# Altium project 88DianZhen.PrjPcb
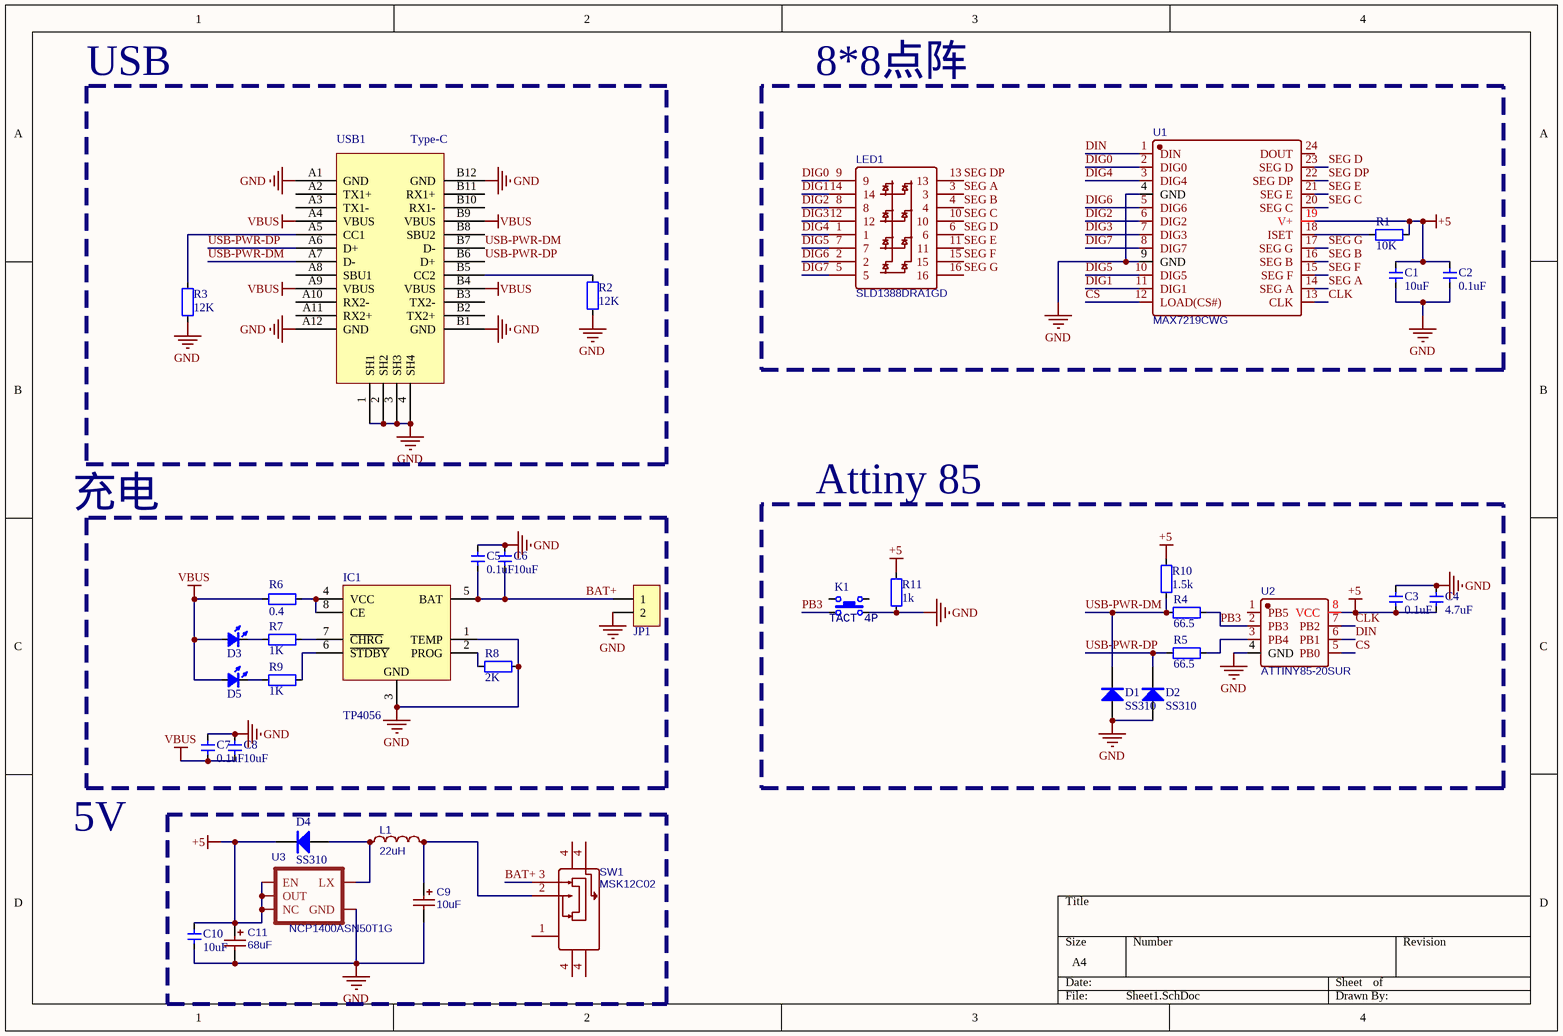
[diagram p0: Sheet1.SchDoc]
1 sheet, 37 parts. Net scope: global (net labels, ports and power ports of the same name join across sheets).
Board file: PCB1.PcbDoc

## Sheet Sheet1.SchDoc
size A4

### Parts
C1  10uF  [CAP_0402]
C2  0.1uF  [CAP_0402]
C3  0.1uF  [CAP_0402]
C4  4.7uF  [CAP_0402]
C5  0.1uF  [CAP_0402]
C6  10uF  [CAP_0402]
C7  0.1uF  [CAP_0402]
C8  10uF  [CAP_0402]
C9  10uF  [CAP-SMD_L3.2-W1.6-RD]
C10  10uF  [CAP_0402]
C11  68uF  [CAP-SMD_L3.5-W2.8]
D1  SS310  [SMA]
D2  SS310  [SMA]
D3  color?  [LED_0402_RED]  (value not drawn)
D4  SS310  [SMA]
D5  color?  [LED_0402_RED]  (value not drawn)
IC1  TP4056  [SOP8]
JP1  HDR-1X2  [KF2EDGK-2.54-LI-2P]  (value not drawn)
K1  TACT 4P  [ButtonTACT_3.5*3.55_90]
L1  22uH  [IND-SMD_L4.5-W4.0_SCD0403T]
LED1  SLD1388DRA1GD  [8*8点阵]
R1  10K  [R_0402]
R2  12K  [R_0402]
R3  12K  [R_0402]
R4  66.5  [0603R]
R5  66.5  [0603R]
R6  0.4  [1210R]
R7  1K  [R_0402]
R8  2K  [R_0402]
R9  1K  [R_0402]
R10  1.5k  [R_0402]
R11  1k  [R_0402]
SW1  MSK12C02  [SW-TH_MSK12C02]
U1  MAX7219CWG  [SOIC-24_L15.4-W7.5-P1.27-LS10.3-BL]
U2  ATTINY85-20SUR  [SOIC-8_L5.3-W5.3-P1.27-LS8.2-BL]
U3  NCP1400ASN50T1G  [SOT23-5]
USB1  Type-C  [Type-C-TOP]

### Blocks framed on the sheet
USB: R2 R3 USB1
8*8点阵: C1 C2 LED1 R1 U1
Attiny 85: C3 C4 D1 D2 K1 R4 R5 R10 R11 U2

### Nets
+5: C1.2 C2.2 C3.1 C4.1 C10.2 C11.1 D4.2(K) R1.2 R10.2 R11.2 U1.19(V+) U2.8(VCC) U3.1(EN) U3.2(OUT) U3.3(NC)
GND: C1.1 C2.1 C3.2 C4.2 C5.2 C6.2 C7.2 C8.2 C9.2 C10.1 C11.2 D1.1(A) D2.1(A) IC1.1(TEMP) IC1.3(GND) JP1.2 K1.4 R2.2 R3.2 R8.2 R11.1 U1.4(GND) U1.9(GND) U2.4(GND) U3.4(GND) USB1.1(SH1) USB1.2(SH2) USB1.3(SH3) USB1.4(SH4) USB1.A1(GND) USB1.A12(GND) USB1.B1(GND) USB1.B12(GND)
VBUS: C7.1 C8.1 D3.1(A) D5.1(A) R6.2 USB1.A4(VBUS) USB1.A9(VBUS) USB1.B4(VBUS) USB1.B9(VBUS)
BAT+: C5.1 C6.1 IC1.5(BAT) JP1.1 SW1.3
CLK: U1.13(CLK) U2.7(PB2)
CS: U1.12(LOAD(CS#)) U2.5(PB0)
DIG0: LED1.9 U1.2(DIG0)
DIG1: LED1.14 U1.11(DIG1)
DIG2: LED1.8 U1.6(DIG2)
DIG3: LED1.12 U1.7(DIG3)
DIG4: LED1.1 U1.3(DIG4)
DIG5: LED1.7 U1.10(DIG5)
DIG6: LED1.2 U1.5(DIG6)
DIG7: LED1.5 U1.8(DIG7)
DIN: U1.1(DIN) U2.6(PB1)
PB3: K1.3 R4.2 U2.2(PB3)
SEG A: LED1.3 U1.14(SEG_A)
SEG B: LED1.4 U1.16(SEG_B)
SEG C: LED1.10 U1.20(SEG_C)
SEG D: LED1.6 U1.23(SEG_D)
SEG DP: LED1.13 U1.22(SEG_DP)
SEG E: LED1.11 U1.21(SEG_E)
SEG F: LED1.15 U1.15(SEG_F)
SEG G: LED1.16 U1.17(SEG_G)
USB-PWR-DM: D1.2(K) R4.1 R10.1 USB1.A7(D-) USB1.B7(D-)
USB-PWR-DP: D2.2(K) R5.1 USB1.A6(D+) USB1.B6(D+)
NetC9_1: C9.1 L1.2 SW1.2
NetD3_2: D3.2(K) R7.1
NetD4_1: D4.1(A) L1.1 U3.5(LX)
NetD5_2: D5.2(K) R9.1
NetIC1_2: IC1.2(PROG) R8.1
NetIC1_4: IC1.4(VCC) IC1.8(CE) R6.1
NetIC1_6: IC1.6(~{STDBY}) R9.2
NetIC1_7: IC1.7(~{CHRG}) R7.2
NetR1_1: R1.1 U1.18(ISET)
NetR2_1: R2.1 USB1.B5(CC2)
NetR3_1: R3.1 USB1.A5(CC1)
NetR5_2: R5.2 U2.3(PB4)

Not connected (* = marked no-connect by the designer): K1 1 2; SW1 1 4; U1 24(DOUT); U2 1(PB5); USB1 A2(TX1+) A3(TX1-) A8(SBU1) A10(RX2-) A11(RX2+) B2(TX2+) B3(TX2-) B8(SBU2) B10(RX1-) B11(RX1+)

### Notes on the sheet
- 充电
- 5V

### Library data of the parts
C1-C8 C10 = 电容-0402: Capacitor; Value: 0.1u
C9 C11 = 钽电容: BOM_Manufacturer: Xiangyee; BOM_Manufacturer Part: CA45-A010M106T; nameAlias: Capacitance; Contributor: LCSC; Package Display: Yes; BOM_Supplier: LCSC; BOM_Supplier Part: C127946; BOM_JLCPCB Part Class: Extended Part; spicePre: C; spiceSymbolName: CA45-A010M106T
D1 D2 = SS210: 肖特基二极管; 版权归属: 源创客; BOM名称: 肖特基二极管; 学习资源: www.ooocke.com
D3 D5 = LED_0402: LED; Type: 0402; Value: color?
D4 = 二极管: 肖特基二极管; 版权归属: 源创客; BOM名称: 肖特基二极管; 学习资源: www.ooocke.com
IC1 = TP4056: 锂电池充电管理; 版权归属: 源创客; BOM名称: 锂电池充电管理; 学习资源: www.ooocke.com
JP1 = Header 2: 2P接插件; 版权归属: 源创客; BOM名称: 2P接插件; 学习资源: www.ooocke.com
K1 = ButtonTACT: Button; type: TACT 4P
L1 = 电感: BOM_Manufacturer: TAITEC; BOM_Manufacturer Part: FPI0403F-220M; nameAlias: Inductance; Contributor: LCSC; Package Display: Yes; BOM_Supplier: LCSC; BOM_Supplier Part: C304283; spicePre: L; spiceSymbolName: FPI0403F-220M
LED1 = SLD1388DRA1GD: BOM_Manufacturer: SUNLIGHT; Contributor: LCSC; Package Display: Yes; BOM_Supplier: LCSC; BOM_Supplier Part: C225991; BOM_Manufacturer Part: SLD1388DRA1GD; BOM_JLCPCB Part Class: Extended Part; spicePre: L; spiceSymbolName: SLD1388DRA1GD
R1-R11 = 电阻-0402: Resistor; Value: 22R
SW1 = MSK12C02: BOM_Manufacturer: SHOU HAN; Contributor: LCSC; Package Display: Yes; BOM_Supplier: LCSC; BOM_Supplier Part: C431540; BOM_Manufacturer Part: MSK12C02; BOM_JLCPCB Part Class: Extended Part; spicePre: S; spiceSymbolName: MSK12C02
U1 = MAX7219CWG: BOM_Manufacturer: MAXIM; Package Display: Yes; BOM_Supplier: LCSC; BOM_Manufacturer Part: MAX7219CWG; BOM_Supplier Part: C9964; BOM_JLCPCB Part Class: Extended Part; spicePre: U; spiceSymbolName: MAX7219CWG
U2 = ATTINY85-20SUR: BOM_Manufacturer: MICROCHIP(美国微芯); Contributor: LCSC; Package Display: Yes; BOM_Supplier: LCSC; BOM_Supplier Part: C2693737; BOM_Manufacturer Part: ATTINY85-20SUR; BOM_JLCPCB Part Class: Extended Part; spicePre: U; spiceSymbolName: ATTINY85-20SUR
U3 = NCP1400ASN50T1G: Contributor: SparkFun; spicePre: U; spiceSymbolName: V_REG_NCP1400SOT23-5
USB1 = USB-Type-C-TOP